# EAGLE design shield (EAGLE 7.5.0)
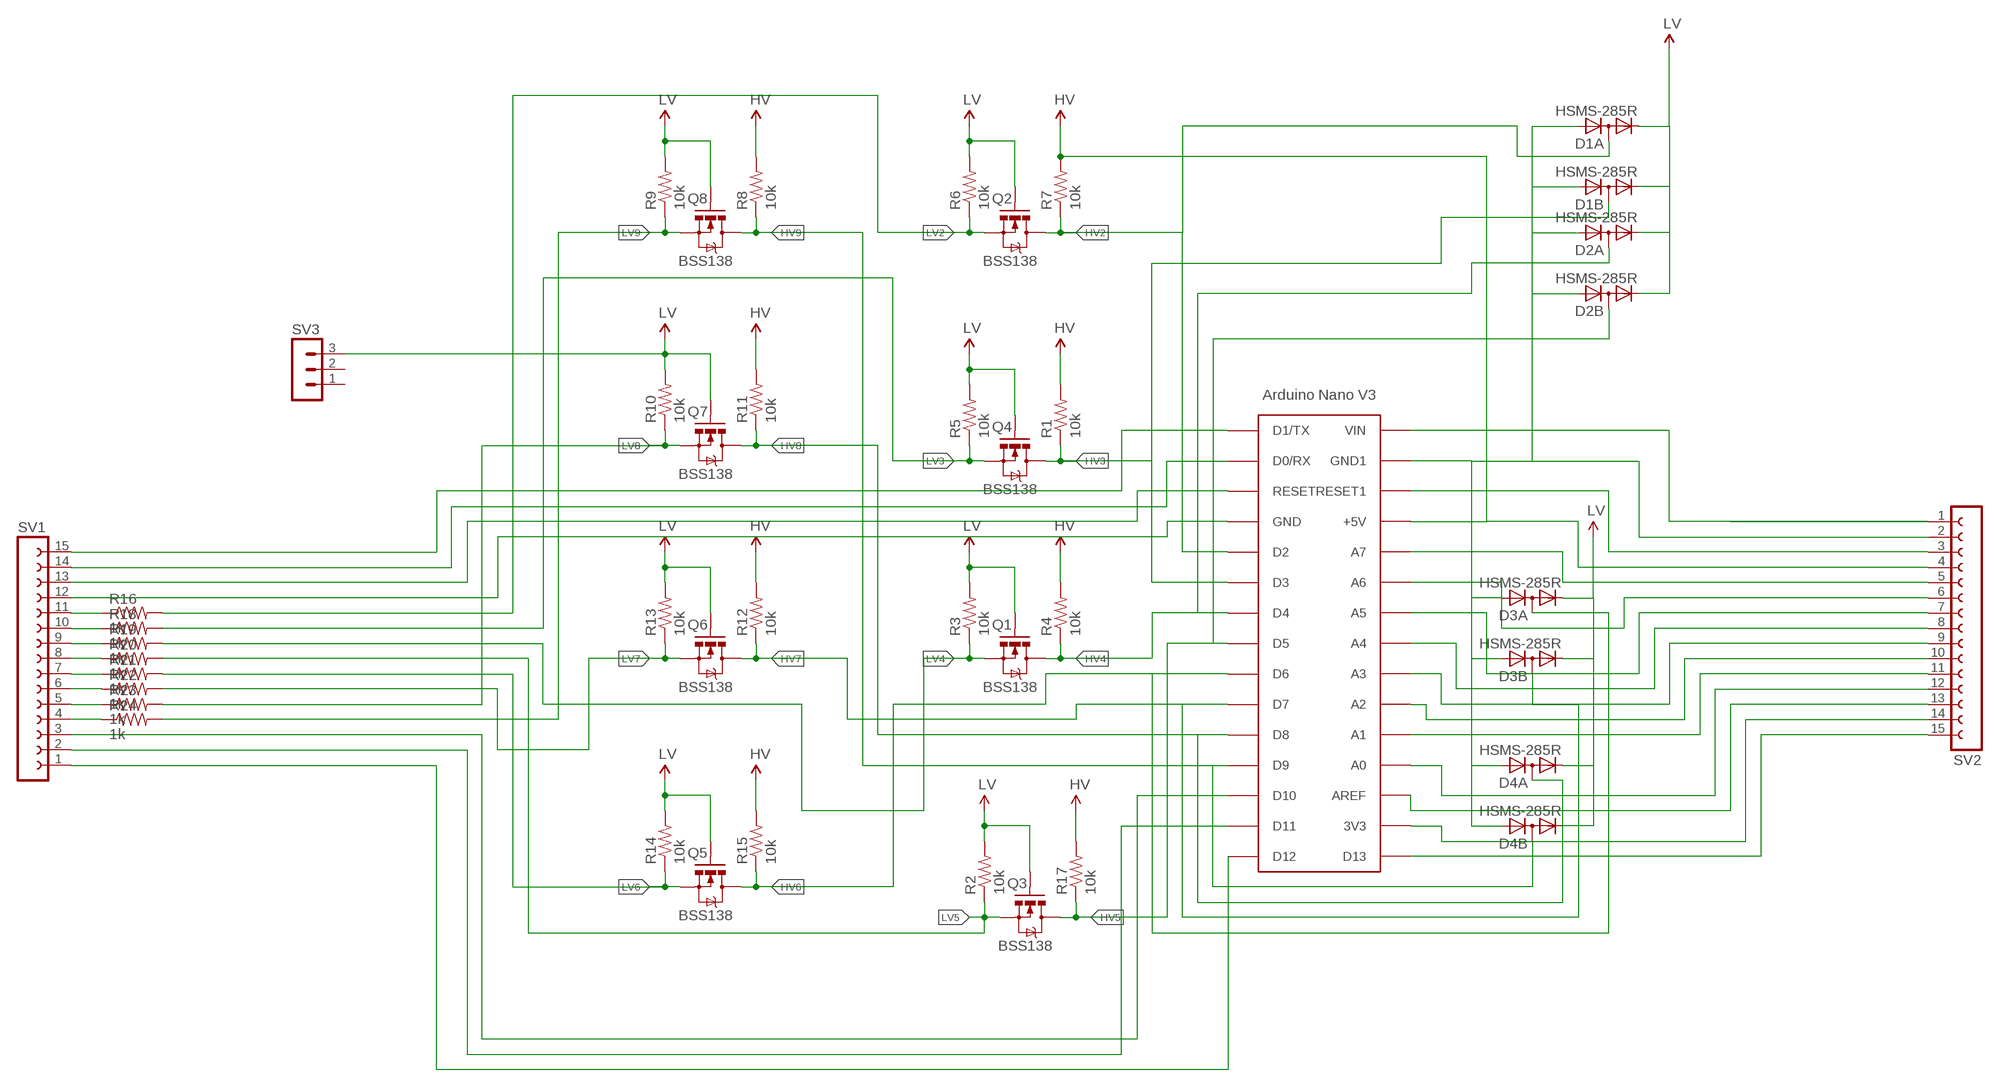
[diagram p0: schematic, sheet 1]

## Parts
D1  HSMS-285R  [SOT363]
D2  HSMS-285R  [SOT363]
D3  HSMS-285R  [SOT363]
D4  HSMS-285R  [SOT363]
Q1  BSS138  MOSFET-NCHANNELSMD  [SOT23-3]
Q2  BSS138  MOSFET-NCHANNELSMD  [SOT23-3]
Q3  BSS138  MOSFET-NCHANNELSMD  [SOT23-3]
Q4  BSS138  MOSFET-NCHANNELSMD  [SOT23-3]
Q5  BSS138  MOSFET-NCHANNELSMD  [SOT23-3]
Q6  BSS138  MOSFET-NCHANNELSMD  [SOT23-3]
Q7  BSS138  MOSFET-NCHANNELSMD  [SOT23-3]
Q8  BSS138  MOSFET-NCHANNELSMD  [SOT23-3]
R1  10k  R-US_R0402  [R0402]
R2  10k  R-US_R0402  [R0402]
R3  10k  R-US_R0402  [R0402]
R4  10k  R-US_R0402  [R0402]
R5  10k  R-US_R0402  [R0402]
R6  10k  R-US_R0402  [R0402]
R7  10k  R-US_R0402  [R0402]
R8  10k  R-US_R0402  [R0402]
R9  10k  R-US_R0402  [R0402]
R10  10k  R-US_R0402  [R0402]
R11  10k  R-US_R0402  [R0402]
R12  10k  R-US_R0402  [R0402]
R13  10k  R-US_R0402  [R0402]
R14  10k  R-US_R0402  [R0402]
R15  10k  R-US_R0402  [R0402]
R16  1k  R-US_R0402  [R0402]
R17  10k  R-US_R0402  [R0402]
R18  1k  R-US_R0402  [R0402]
R19  1k  R-US_R0402  [R0402]
R20  1k  R-US_R0402  [R0402]
R21  1k  R-US_R0402  [R0402]
R22  1k  R-US_R0402  [R0402]
R23  1k  R-US_R0402  [R0402]
R24  1k  R-US_R0402  [R0402]
SV1  FE15-1  [FE15]
SV2  FE15-1  [FE15]
SV3  MA03-1  [MA03-1]
U$1  ARDUINONANO  [PDIP-32]

## Nets
HV: R1.2 R4.2 R7.2 R8.2 R11.2 R12.2 R15.2 R17.2 SV2.4 U$1.+5V
HV2: D1.2(A:AC) Q2.3(D) R7.1 U$1.D2
HV3: D1.5(B:AC) Q4.3(D) R1.1 U$1.D3
HV4: D2.2(A:AC) Q1.3(D) R4.1 U$1.D4
HV5: D2.5(B:AC) Q3.3(D) R17.1 U$1.D5
HV6: D3.2(A:AC) Q5.3(D) R15.1 U$1.D6
HV7: D3.5(B:AC) Q6.3(D) R12.1 U$1.D7
HV8: D4.2(A:AC) Q7.3(D) R11.1 U$1.D8
HV9: D4.5(B:AC) Q8.3(D) R8.1 U$1.D9
LV: D1.1(A:C) D1.4(B:C) D2.1(A:C) D2.4(B:C) D3.1(A:C) D3.4(B:C) D4.1(A:C) D4.4(B:C) Q1.1(G) Q2.1(G) Q3.1(G) Q4.1(G) Q5.1(G) Q6.1(G) Q7.1(G) Q8.1(G) R2.2 R3.2 R5.2 R6.2 R9.2 R10.2 R13.2 R14.2 SV3.3
LV2: Q2.2(S) R6.1 R16.2
LV3: Q4.2(S) R5.1 R18.2
LV4: Q1.2(S) R3.1 R19.2
LV5: Q3.2(S) R2.1 R20.2
LV6: Q5.2(S) R14.1 R21.2
LV7: Q6.2(S) R13.1 R22.2
LV8: Q7.2(S) R10.1 R23.2
LV9: Q8.2(S) R9.1 R24.2
N$1: D1.3(A:A) D1.6(B:A) D2.3(A:A) D2.6(B:A) D3.3(A:A) D3.6(B:A) D4.3(A:A) D4.6(B:A) SV2.2 U$1.GND1
N$2: SV2.9 U$1.A4(A3)
N$3: SV2.10 U$1.A5(A2)
N$4: SV2.11 U$1.A6(A1)
N$5: SV2.12 U$1.A7(A0)
N$6: SV2.13 U$1.AREF
N$7: SV2.14 U$1.3V3
N$8: SV2.15 U$1.D13
N$9: SV2.8 U$1.A3(A4)
N$10: SV2.7 U$1.A2(A5)
N$11: SV2.6 U$1.A1(A6)
N$12: SV2.5 U$1.A0(A7)
N$13: R16.1 SV1.11
N$14: SV2.3 U$1.RESET1
N$16: SV2.1 U$1.VIN
N$17: SV1.15 U$1.D1/TX
N$18: SV1.14 U$1.D0/RX
N$19: SV1.13 U$1.RESET
N$20: SV1.12 U$1.GND
N$22: R18.1 SV1.10
N$23: R19.1 SV1.9
N$24: R20.1 SV1.8
N$25: R21.1 SV1.7
N$26: R22.1 SV1.6
N$27: R23.1 SV1.5
N$28: R24.1 SV1.4
N$29: SV1.3 U$1.D10
N$30: SV1.2 U$1.D11
N$31: SV1.1 U$1.D12
Unconnected: SV3.1 SV3.2

## Library data of the parts
D1-D4 = avago:HSMS-285R: Surface Mount Microwave Schottky Detector Diodes Ring Quad Source: Data sheet <http://www.farnell.com/datasheets/461166.pdf>
Q1-Q8 = SparkFun:MOSFET-NCHANNEL
R1-R24 = resistor:R-US_: RESISTOR, American symbol
SV1 SV2 = con-lsta:FE15-1: FEMALE HEADER; OC_FARNELL: unknown; OC_NEWARK: unknown
SV3 = con-lstb:MA03-1: PIN HEADER; OC_FARNELL: unknown; OC_NEWARK: unknown
U$1 = CRE-Lib1:ARDUINONANO: Arduino Nano

## Board
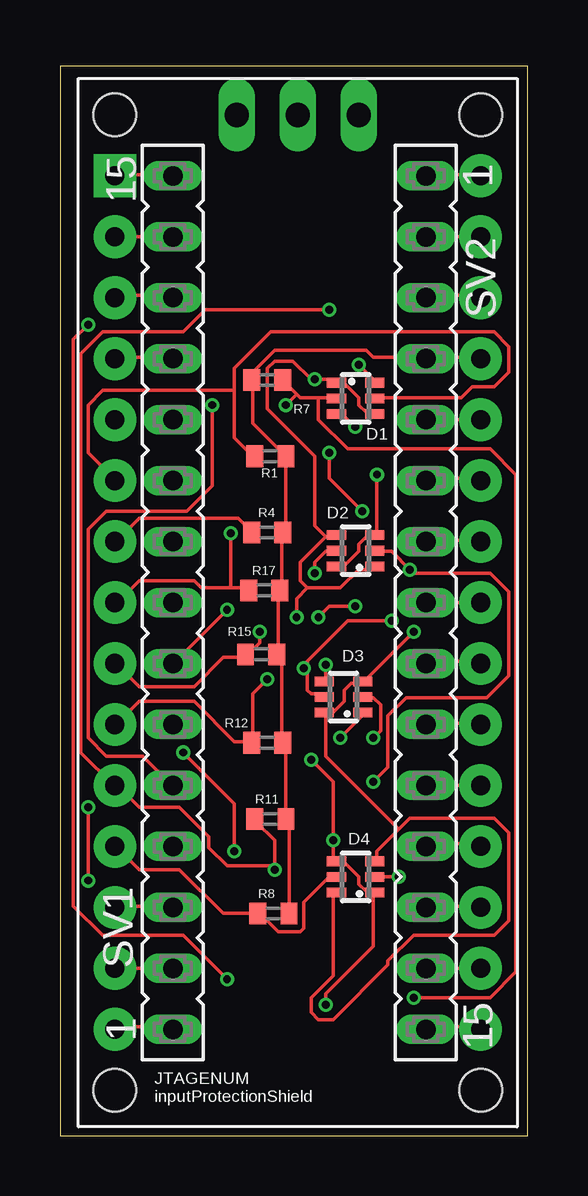
[diagram p1: board, top side]
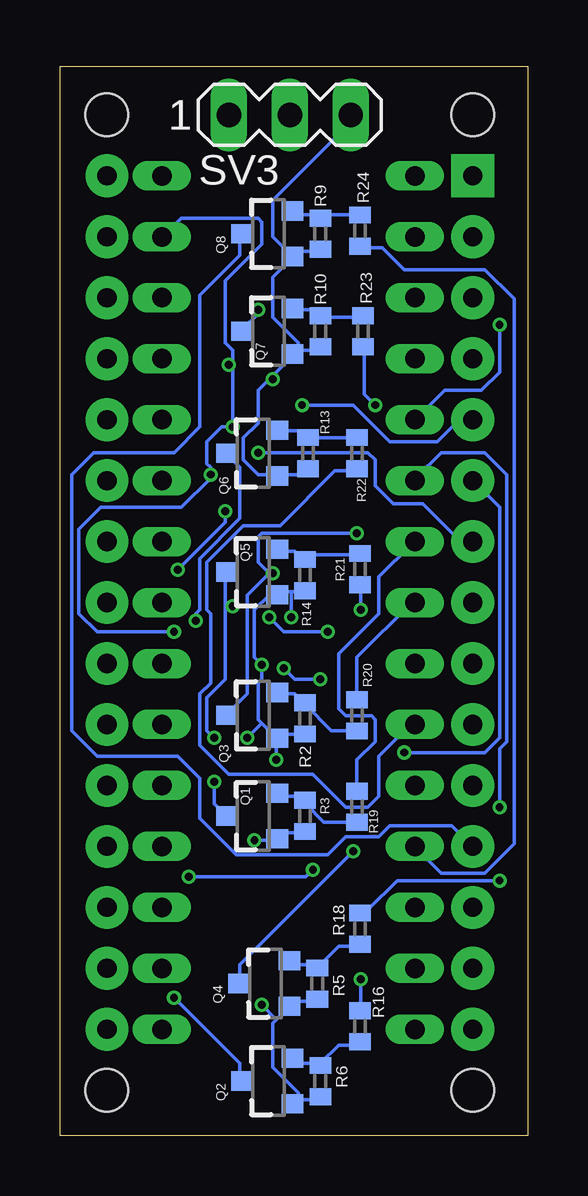
[diagram p2: board, bottom side, seen from below]

Size 19.48 x 44.57 mm. Coordinates in mm from the lower left corner, seen from the top.
Outline: 0,0 19.48,0 19.48,44.57 0,44.57 0,0
Copper layers (1*16): Top 0.035559375mm / dielectric 1.6mm / Bottom 0.035559375mm
Design rules "oshpark-2layer": minimum track width 6mil, minimum drill 10mil, track to track 6mil, track to pad 6mil, pad to pad 6mil, via to via 6mil, smd to smd 6mil, copper to edge 15mil, drill to drill 6mil, minimum pad ring 5mil, minimum via ring 5mil, stop-mask expansion 2.5mil, vias tented up to drill 0mil, thermal gap 10mil

### Footprints (pad centres in the part's own frame; a part is rotated, then mirrored left to right if it is on the bottom)
SOT363 = smd 0.4 x 0.8: 1 -0.65,-0.8; 2 0,-0.8; 3 0.65,-0.8; 4 0.65,0.8; 5 0,0.8; 6 -0.65,0.8
SOT23-3 = smd 0.8 x 0.9: 1 -0.95,-1; 2 0.95,-1; 3 0,1.1
R0402 = smd 0.7 x 0.9: 1 -0.65,0; 2 0.65,0
FE15 = drill 0.813 long: 1 -17.78,0; 2 -15.24,0; 3 -12.7,0; 4 -10.16,0; 5 -7.62,0; 6 -5.08,0; 7 -2.54,0; 8 0,0; 9 2.54,0; 10 5.08,0; 11 7.62,0; 12 10.16,0; 13 12.7,0; 14 15.24,0; 15 17.78,0
MA03-1 = drill 1.016 long: 1 -2.54,0; 2 0,0; 3 2.54,0
PDIP-32 = drill 0.8 pad 1.778: 3V3 15.24,-35.56; +5V 15.24,-10.16; A0 15.24,-12.7; A1 15.24,-15.24; A2 15.24,-17.78; A3 15.24,-20.32; A4 15.24,-22.86; A5 15.24,-25.4; A6 15.24,-27.94; A7 15.24,-30.48; AREF 15.24,-33.02; D0/RX 0,-5.08; D2 0,-12.7; D3 0,-15.24; D4 0,-17.78; D5 0,-20.32; D6 0,-22.86; D7 0,-25.4; D8 0,-27.94; D9 0,-30.48; D10 0,-33.02; D11 0,-35.56; D12 0,-38.1; D13 15.24,-38.1; GND 0,-10.16; GND1 15.24,-5.08; RESET 0,-7.62; RESET1 15.24,-7.62; VIN 15.24,-2.54 | drill 0.8 pad 1.778 square: D1/TX 0,-2.54 | hole 1.778: 0,0; 0,-40.64; 15.24,-40.64; 15.24,0

### Placement (x,y rotation side)
D1  12.32,30.73 270 top
D2  12.32,24.38 90 top
D3  11.81,18.29 90 top
D4  12.32,10.79 90 top
Q1  11.43,13.33 90 bottom
Q2  10.79,2.29 90 bottom
Q3  11.43,17.53 90 bottom
Q4  10.92,6.35 90 bottom
Q5  11.43,23.49 90 bottom
Q6  11.43,28.45 90 bottom
Q7  10.79,33.53 90 bottom
Q8  10.79,37.59 90 bottom
R1  8.76,28.32 0 top
R2  9.27,17.4 270 bottom
R3  9.27,13.33 270 bottom
R4  8.64,25.15 0 top
R5  8.76,6.35 270 bottom
R6  8.64,2.29 270 bottom
R7  8.64,31.5 180 top
R8  8.89,9.27 0 top
R9  8.64,37.59 270 bottom
R10  8.64,33.53 270 bottom
R11  8.76,13.21 0 top
R12  8.64,16.38 0 top
R13  9.14,28.45 270 bottom
R14  9.27,23.37 270 bottom
R15  8.38,20.07 0 top
R16  6.99,4.57 270 bottom
R17  8.51,22.73 0 top
R18  6.99,8.64 270 bottom
R19  7.11,13.72 270 bottom
R20  7.11,17.53 270 bottom
R21  6.99,23.62 90 bottom
R22  7.11,28.45 90 bottom
R23  6.86,33.53 90 bottom
R24  6.99,37.72 90 bottom
SV1  4.7,22.23 90 top
SV2  15.24,22.23 270 top
SV3  9.91,42.54 0 bottom
U$1  2.29,42.54 0 top

### Tracks (layer width: path | path; a pad name or v marks a point on that pad's centre or on a via)
HV
  Top 0.152: U$1.+5V 17.47,32.44 15.34,32.44 SV2.4 15.19,32.44 13.06,32.44 12.75,32.74 8.94,32.74 8.03,31.83 8.03,31.52 R7.2 8.03,31.37 8.03,29.69 9.4,28.32 | R8.2 9.55,9.27 9.55,13.08 R11.2 9.4,13.23 9.4,16.28 R12.2 9.25,16.43 9.25,19.79 9.09,19.94 R15.2 9.09,20.09 9.09,22.68 R17.2 9.25,22.84 9.25,25.12 R4.2 9.4,25.27 9.4,28.32 | 9.4,28.32 R1.2
HV2  (via drill 0.33)
  Top 0.152: 10.77,30.76 10.01,30.76 9.86,30.91 | 10.77,30.76 11.38,30.76 D1.2 | 9.86,30.91 9.4,31.37 R7.1 | v14.73,5.77 17.93,5.77 19,6.83 19,27.56 17.93,28.63 11.99,28.63 10.77,29.84 10.77,30.76 | 9.86,30.91 v9.4,30.45
  Bottom 0.152: v14.73,5.77 11.99,3.02 11.99,2.41 Q2.3 | U$1.D2 2.84,29.84 3.76,28.93 5.74,28.93 7.26,30.45 v9.4,30.45
HV3  (via drill 0.33)
  Top 0.152: 7.26,31.06 7.26,29.08 8.03,28.32 R1.1 | 7.26,31.06 7.26,31.98 8.79,33.5 18.08,33.5 18.69,32.89 18.69,31.83 18.08,31.22 17.17,31.22 16.71,30.76 13.21,30.76 D1.5 | v7.26,11.86 7.26,13.84 v5.13,15.98 | 7.26,31.06 1.78,31.06 1.17,30.45 1.17,28.47 2.23,27.41 U$1.D3
  Bottom 0.152: v7.26,11.86 11.99,7.14 11.99,6.38 Q4.3 | v5.13,15.98 1.78,15.98 1.17,16.59 1.17,26.19 U$1.D3
HV4  (via drill 0.33)
  Top 0.152: R4.1 7.87,25.27 7.42,25.73 3.3,25.73 2.39,24.82 U$1.D4 | v13.06,14.76 13.67,15.37 13.67,17.5 14.43,18.26 17.78,18.26 18.69,19.18 18.69,22.68 17.93,23.44 14.73,23.44 v14.58,23.6 13.82,24.36 13.21,24.36 D2.2 | v11.23,28.47 11.23,27.41 v12.6,26.03
  Bottom 0.152: v13.06,14.76 13.06,13.84 12.6,13.39 Q1.3 | v11.23,28.47 6.65,28.47 6.35,28.17 6.35,27.1 5.59,26.34 4.37,26.34 2.84,24.82 2.39,24.82 U$1.D4 | v12.6,26.03 12.6,25.58 v14.58,23.6
HV5  (via drill 0.33)
  Top 0.152: v10.62,23.44 10.62,23.9 11.07,24.36 11.38,24.36 D2.5 | 7.11,22.84 5.89,22.84 5.59,23.14 3.3,23.14 2.39,22.23 U$1.D5 | 7.11,22.84 7.72,22.84 R17.1 | 7.11,22.84 v7.11,25.12
  Bottom 0.152: 10.77,23.44 11.68,22.53 11.68,18.41 12.45,17.65 Q3.3 | 10.77,23.44 11.23,23.9 11.23,24.97 11.07,25.12 v7.11,25.12 | 10.77,23.44 v10.62,23.44
HV6  (via drill 0.33)
  Top 0.152: v13.06,16.59 13.36,16.89 13.36,17.96 13.06,18.26 12.75,18.26 D3.2 | U$1.D6 2.39,19.63 3.3,18.72 5.59,18.72 6.81,19.94 7.72,19.94 R15.1 7.87,20.09 8.33,20.55 v8.33,21.01 | v12.29,22.07 11.23,22.07 v10.77,21.62
  Bottom 0.152: v13.06,16.59 13.36,16.89 13.36,18.26 12.6,19.02 12.6,22.07 | 12.6,22.07 12.6,23.44 Q5.3 | v12.29,22.07 12.6,22.07 | v10.77,21.62 10.16,21.01 v8.33,21.01
HV7  (via drill 0.33)
  Top 0.152: U$1.D7 2.39,17.2 3.3,18.11 5.59,18.11 7.26,16.43 7.87,16.43 R12.1 8.03,16.43 8.03,18.41 v8.64,19.02 | 10.31,19.48 10.31,19.79 11.99,21.46 v13.82,21.46 | 10.31,19.48 10.31,18.57 10.46,18.41 10.92,18.41 D3.5 | 10.31,19.48 v10.16,19.48
  Bottom 0.152: v13.82,21.46 13.82,21.77 13.67,21.92 13.67,24.05 11.99,25.73 11.99,27.86 12.45,28.32 Q6.3 | v8.64,19.02 9.7,19.02 v10.16,19.48
HV8  (via drill 0.33)
  Top 0.152: v14.12,10.79 D4.2 | 8.94,11.25 8.94,12.32 8.18,13.08 R11.1 | v11.23,34.42 6.05,34.42 5.13,33.5 1.78,33.5 0.86,32.59 0.86,15.98 2.23,14.6 U$1.D8 2.39,14.6 3.3,13.69 4.98,13.69 6.2,12.47 6.2,12.01 6.96,11.25 8.94,11.25 | 8.94,11.25 v8.94,11.1
  Bottom 0.152: v14.12,10.79 9.25,10.79 v8.94,11.1 | v11.23,34.42 11.23,34.27 11.84,33.65 Q7.3
HV9
  Top 0.152: D4.5 11.23,10.79 10.16,9.73 10.16,8.66 10.01,8.51 9.09,8.51 8.33,9.27 R8.1 6.81,9.27 4.98,11.1 3.3,11.1 2.39,12.01 U$1.D9
  Bottom 0.152: U$1.D9 3.15,12.93 5.74,12.93 6.2,12.47 7.57,12.47 8.33,11.71 12.14,11.71 13.67,13.23 13.67,14.91 14.58,15.82 17.93,15.82 19,16.89 19,27.56 18.08,28.47 14.73,28.47 13.67,29.54 13.67,35.03 11.99,36.7 11.99,37.46 Q8.3
LV  (via drill 0.33)
  Top 0.152: v11.07,5.46 11.07,5.92 13.06,7.9 13.06,10.03 D4.1 13.06,10.19 12.75,10.19 12.45,10.49 12.45,10.79 11.84,11.4 11.53,11.4 D4.4 11.38,11.56 v11.38,12.32 11.38,14.76 v10.46,15.67 | v11.07,19.63 11.07,19.02 D3.4 | v11.68,16.59 12.6,17.5 D3.1 | D1.4 13.06,30.15 12.75,30.15 12.45,30.45 12.45,30.76 11.84,31.37 11.53,31.37 D1.1 11.38,31.52 v10.62,31.52 10.46,31.52 9.7,32.28 8.94,32.28 8.64,31.98 8.64,30.3 10.62,28.32 10.62,25.42 11.07,24.97 | 10.31,22.84 11.68,22.84 12.45,23.6 13.06,23.6 D2.1 | 10.31,22.84 10.01,23.14 10.01,23.9 11.07,24.97 | 11.07,24.97 11.38,24.97 D2.4 | v9.86,21.62 9.86,22.38 10.31,22.84
  Bottom 0.152: R13.2 9.25,27.71 9.4,27.56 10.31,27.56 Q6.1 10.46,27.56 11.23,27.56 11.84,28.17 11.84,29.08 11.23,29.69 11.23,31.06 10.62,31.67 | 9.55,32.74 8.64,32.74 R10.2 | 9.55,32.74 9.7,32.59 Q7.1 | R9.2 8.64,36.85 9.55,36.85 9.7,36.7 Q8.1 | 9.55,32.74 9.55,33.04 10.62,34.11 10.62,35.79 9.86,36.55 Q8.1 | 9.55,32.74 Q7.1 | 10.62,31.67 9.86,32.44 Q7.1 | SV3.3 7.42,42.49 7.42,42.19 10.62,38.99 10.62,37.46 9.86,36.7 Q8.1 | 9.55,1.5 8.64,1.5 R6.2 | 9.55,1.5 9.7,1.35 Q2.1 9.55,1.5 | R5.2 8.79,5.61 9.7,5.61 9.86,5.46 Q4.1 10.01,5.31 10.46,4.85 | 9.55,1.5 9.55,1.8 10.62,2.87 10.62,4.7 10.46,4.85 | R3.2 9.4,12.62 10.16,12.62 10.31,12.47 Q1.1 10.46,12.32 v11.38,12.32 | v11.07,5.46 10.46,4.85 | 9.86,22.68 10.31,22.68 Q5.1 10.46,22.53 10.77,22.53 11.38,21.92 11.38,19.94 v11.07,19.63 11.07,19.02 11.23,18.87 11.23,17.35 11.07,17.2 | 9.86,22.68 9.4,22.68 R14.2 | 11.07,17.2 10.46,16.59 Q3.1 | 11.07,17.2 v11.68,16.59 | R2.2 9.4,16.74 10.16,16.74 10.31,16.59 Q3.1 | v9.86,21.62 9.86,22.68 | v10.46,15.67 10.46,16.43 Q3.1 | v10.62,31.52 10.62,31.67
LV2
  Bottom 0.152: 8.64,3.02 9.55,3.02 9.7,3.17 Q2.2 | 8.64,3.02 7.87,3.78 7.11,3.78 R16.2 | 8.64,3.02 R6.1
LV3
  Bottom 0.152: Q4.2 9.86,7.29 9.7,7.14 8.79,7.14 R5.1 8.64,7.14 7.87,7.9 7.11,7.9 R18.2
LV4
  Bottom 0.152: R19.2 7.11,13.08 8.48,13.08 9.25,13.84 R3.1 9.4,13.99 9.55,14.15 10.31,14.15 Q1.2
LV5
  Bottom 0.152: R20.2 7.11,16.89 8.18,16.89 9.25,17.96 R2.1 9.4,18.11 9.7,18.41 10.31,18.41 Q3.2
LV6
  Bottom 0.152: R21.2 7.11,24.21 9.09,24.21 9.25,24.05 R14.1 9.4,24.05 9.7,24.36 10.31,24.36 Q5.2
LV7
  Bottom 0.152: R22.2 7.11,29.08 9.09,29.08 R13.1 9.25,29.23 9.4,29.39 10.31,29.39 Q6.2
LV8
  Bottom 0.152: R23.2 6.96,34.11 8.64,34.11 R10.1 8.64,34.27 8.79,34.42 9.7,34.42 Q7.2
LV9
  Bottom 0.152: 8.64,38.38 9.55,38.38 9.7,38.53 Q8.2 | 8.64,38.38 7.11,38.38 R24.2 | 8.64,38.38 R9.1
N$1  (via drill 0.33)
  Top 0.152: 14.12,12.78 13.21,11.86 13.21,11.56 D4.3 | 14.12,12.78 14.58,13.23 18.08,13.23 18.69,12.62 18.69,8.97 18.08,8.36 14.73,8.36 13.67,7.29 13.67,7.14 11.38,4.85 10.77,4.85 10.46,5.16 10.46,5.77 11.38,6.68 11.38,10.03 D4.6 | 14.12,12.78 11.07,15.82 11.07,17.5 D3.6 11.07,17.65 11.38,17.65 11.84,18.11 11.84,18.57 12.14,18.87 12.6,18.87 D3.3 12.75,19.02 v14.73,21.01 | D2.6 11.53,23.75 11.84,23.75 12.45,24.36 12.45,24.66 12.75,24.97 13.06,24.97 D2.3 13.21,25.12 v13.21,27.56 | v12.29,29.54 11.84,30 11.53,30 D1.3 | v12.45,32.13 13.06,31.52 D1.6 | SV2.2 U$1.GND1
  Bottom 0.152: 12.29,32.13 12.29,32.74 12.6,33.04 12.6,35.64 11.07,37.16 11.07,38.07 11.23,38.23 14.43,38.23 15.19,37.46 SV2.2 | 12.29,32.13 v12.29,29.54 12.75,29.54 13.36,28.93 13.36,28.02 13.21,27.86 v13.21,27.56 13.21,27.41 14.43,26.19 17.78,26.19 18.69,25.27 18.69,21.77 17.93,21.01 v14.73,21.01 | 12.29,32.13 v12.45,32.13
N$2
  Top 0.152: SV2.9 15.34,19.79 17.47,19.79 U$1.A4
N$3
  Top 0.152: SV2.10 15.34,17.2 17.47,17.2 U$1.A5
N$4
  Top 0.152: U$1.A6 SV2.11
N$5
  Top 0.152: SV2.12 15.34,12.17 17.47,12.17 U$1.A7
N$6
  Top 0.152: SV2.13 15.34,9.58 17.47,9.58 U$1.AREF
N$7
  Top 0.152: U$1.3V3 SV2.14
N$8
  Top 0.152: SV2.15 15.34,4.55 17.47,4.55 U$1.D13
N$9
  Top 0.152: U$1.A3 SV2.8
N$10
  Top 0.152: SV2.7 15.34,24.82 17.47,24.82 U$1.A2
N$11
  Top 0.152: SV2.6 15.34,27.41 17.47,27.41 U$1.A1
N$12
  Top 0.152: U$1.A0 SV2.5
N$13  (via drill 0.33)
  Top 0.152: v6.96,6.53 5.13,8.36 1.78,8.36 0.56,9.58 0.56,33.2 v1.17,33.81
  Bottom 0.152: v6.96,6.53 6.96,5.31 R16.1 | v1.17,33.81 1.17,31.83 1.93,31.06 3.45,31.06 4.67,29.84 SV1.11
N$14
  Top 0.152: SV2.3 15.34,35.03 17.47,35.03 U$1.RESET1
N$16
  Top 0.152: SV2.1 15.34,40.06 17.47,40.06 U$1.VIN
N$17
  Top 0.152: SV1.15 4.67,40.06 2.39,40.06 U$1.D1/TX
N$18
  Top 0.152: U$1.D0/RX SV1.14
N$19
  Top 0.152: SV1.13 4.67,35.03 2.39,35.03 U$1.RESET
N$20
  Top 0.152: SV1.12 4.67,32.44 2.39,32.44 U$1.GND
N$22  (via drill 0.33)
  Top 0.152: v1.17,13.69 v1.17,10.64
  Bottom 0.152: v1.17,10.64 5.44,10.64 6.65,9.42 6.96,9.42 R18.1 | v1.17,13.69 1.17,16.13 0.86,16.43 0.86,27.56 1.78,28.47 3.61,28.47 4.67,27.41 SV1.10
N$23
  Bottom 0.152: R19.1 7.11,15.67 6.35,16.43 6.35,17.35 6.5,17.5 7.57,17.5 7.87,17.8 7.87,20.09 6.2,21.77 6.2,23.29 4.83,24.66 SV1.9
N$24
  Bottom 0.152: R20.1 7.11,19.94 4.83,22.23 SV1.8
N$25  (via drill 0.33)
  Top 0.152: v6.96,21.92 4.83,19.79 SV1.7
  Bottom 0.152: v6.96,21.92 6.96,22.84 R21.1
N$26
  Bottom 0.152: R22.1 7.11,27.71 8.03,27.71 10.31,25.42 11.84,25.42 13.36,23.9 13.36,21.92 13.21,21.77 13.21,18.87 13.67,18.41 13.67,16.28 12.45,15.06 8.94,15.06 7.57,13.69 6.65,13.69 6.2,14.15 6.2,15.82 4.83,17.2 SV1.6
N$27  (via drill 0.33)
  Top 0.152: v6.35,30.45 6.35,27.1 5.28,26.03 1.93,26.03 1.17,25.27 1.17,16.59 1.93,15.82 3.45,15.82 4.67,14.6 SV1.5
  Bottom 0.152: v6.35,30.45 6.81,30.91 6.81,32.74 R23.1
N$28
  Bottom 0.152: R24.1 6.96,37.01 6.05,37.01 5.13,36.09 1.78,36.09 0.56,34.87 0.56,12.17 1.78,10.95 3.61,10.95 4.67,12.01 SV1.4
N$29
  Top 0.152: SV1.3 4.67,9.58 2.39,9.58 U$1.D10
N$30
  Top 0.152: U$1.D11 SV1.2
N$31
  Top 0.152: SV1.1 4.67,4.55 2.39,4.55 U$1.D12

### Text on the board
tNames: JTAGENUM / inputProtectionShield